# Altium schematic sheet UnivCotrollerV1.1.SchDoc
size 839 x 594 mm; ApprovedBy: Фадеев; CheckedBy: Ефименко; Author: Зильков; DrawnBy: Монтволинская; DocumentNumber: 1; SheetNumber: 1; SheetTotal: 1; PageSetup: Record=PageOptions|CenterHorizontal=True|CenterVertical=True|PrintScale=0.94|XCorrection=1.00|YCorrection=1.00|PrintKind=1|BorderSize=5000000|LeftOffset=0|BottomOffset=0|Orientation=1|PaperLength=1000|PaperWidth=1000|Scale=100|PaperSource=7|PrintQuality=-4|MediaType=1|DitherType=10|PaperKind=A4|PrintScaleMode=1; DecimalNumber: АДН200.80.01.100 Э3; MainDevice: АДН200.80.01.100
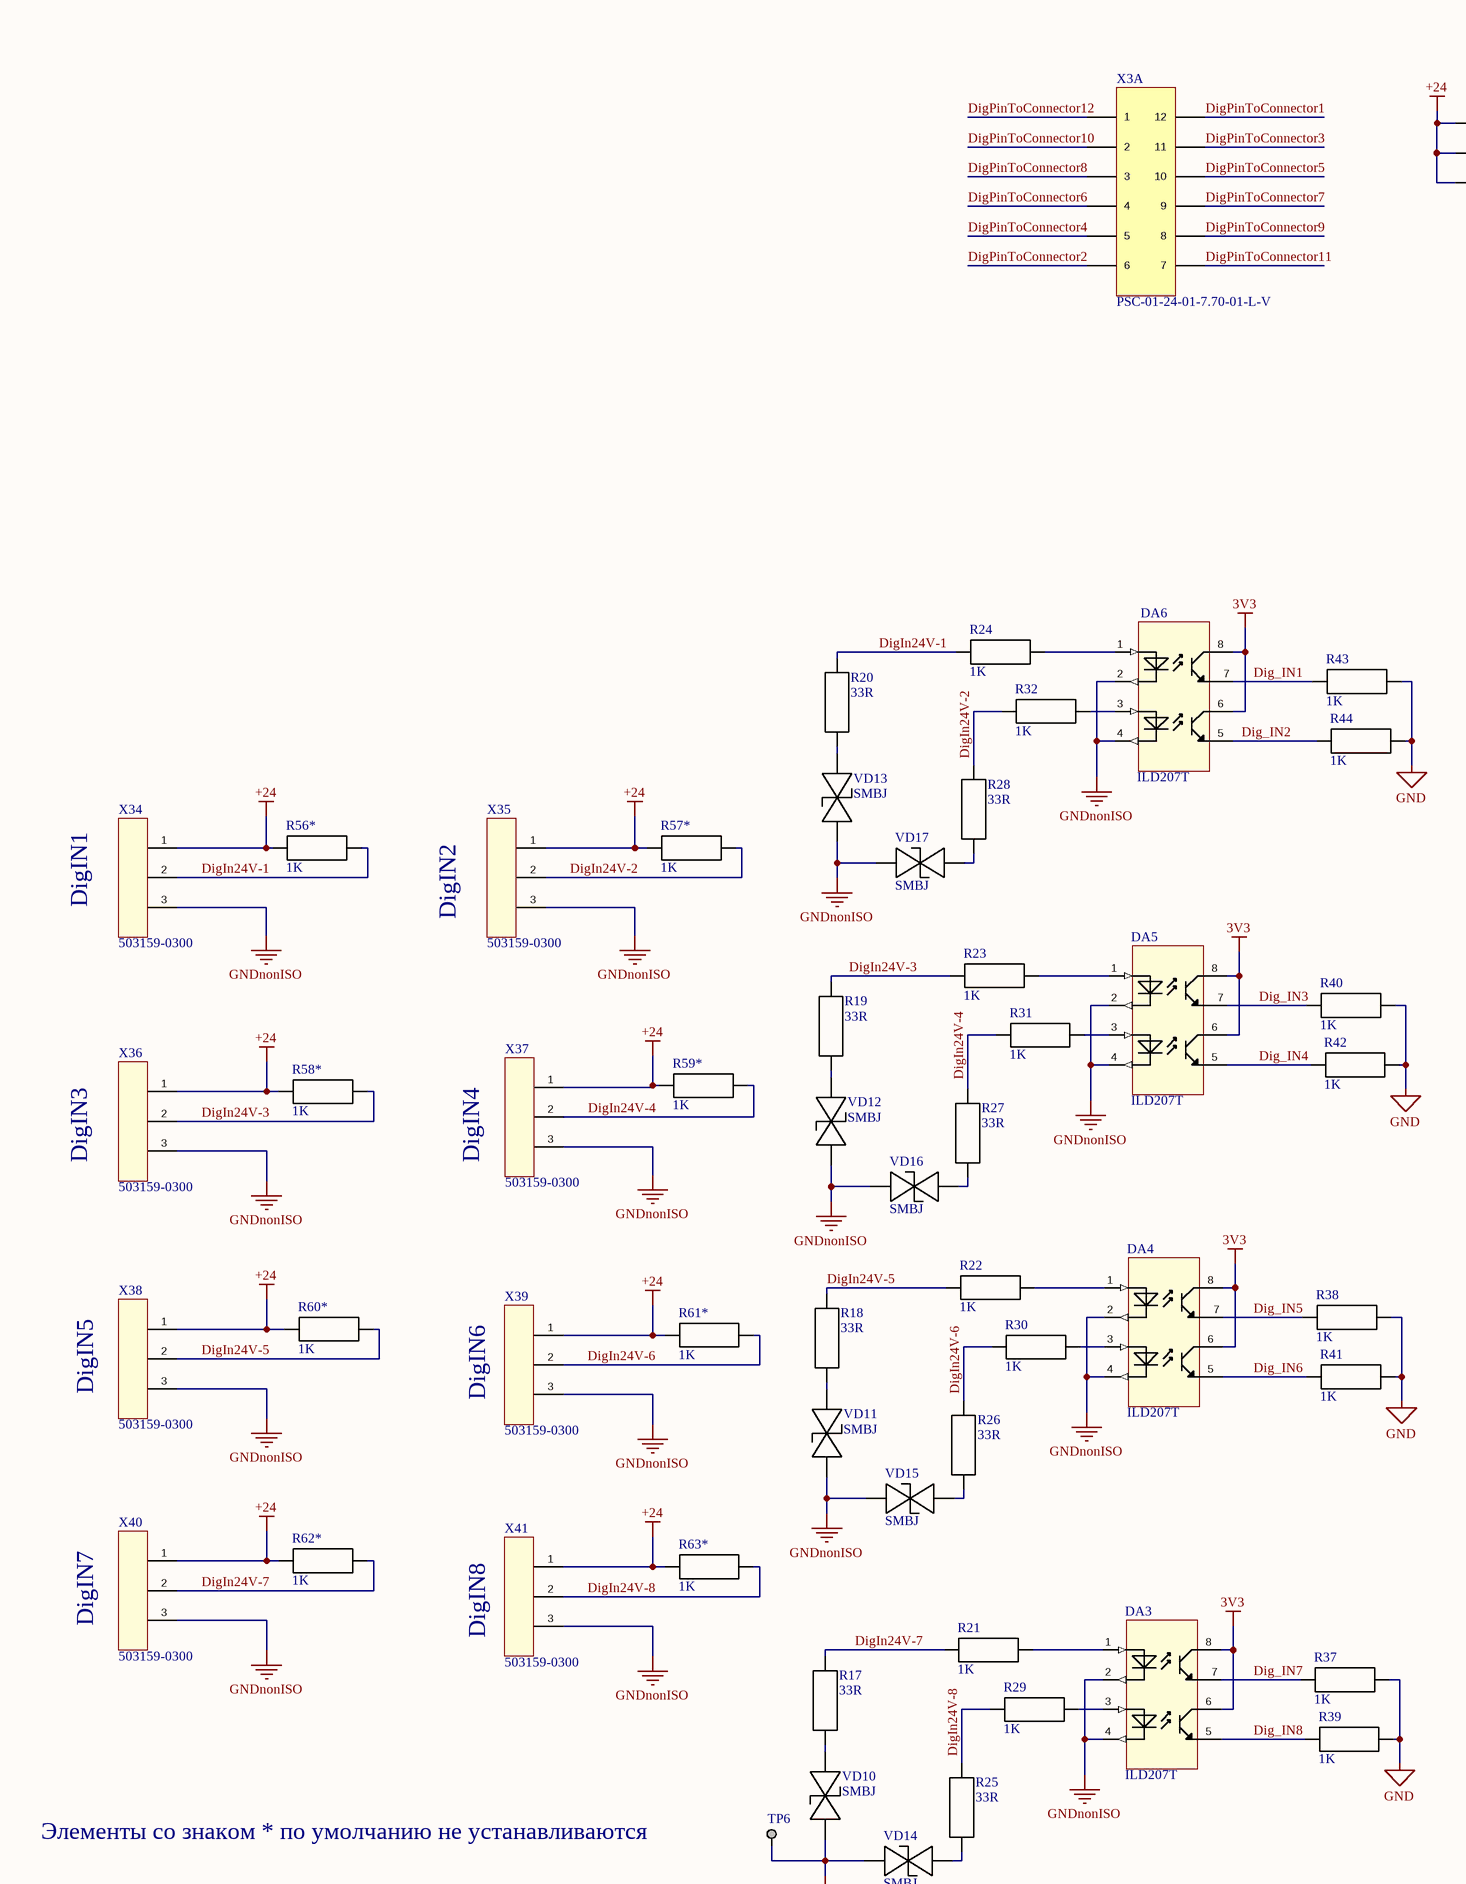
[diagram p0: UnivCotrollerV1.1.SchDoc, top left]
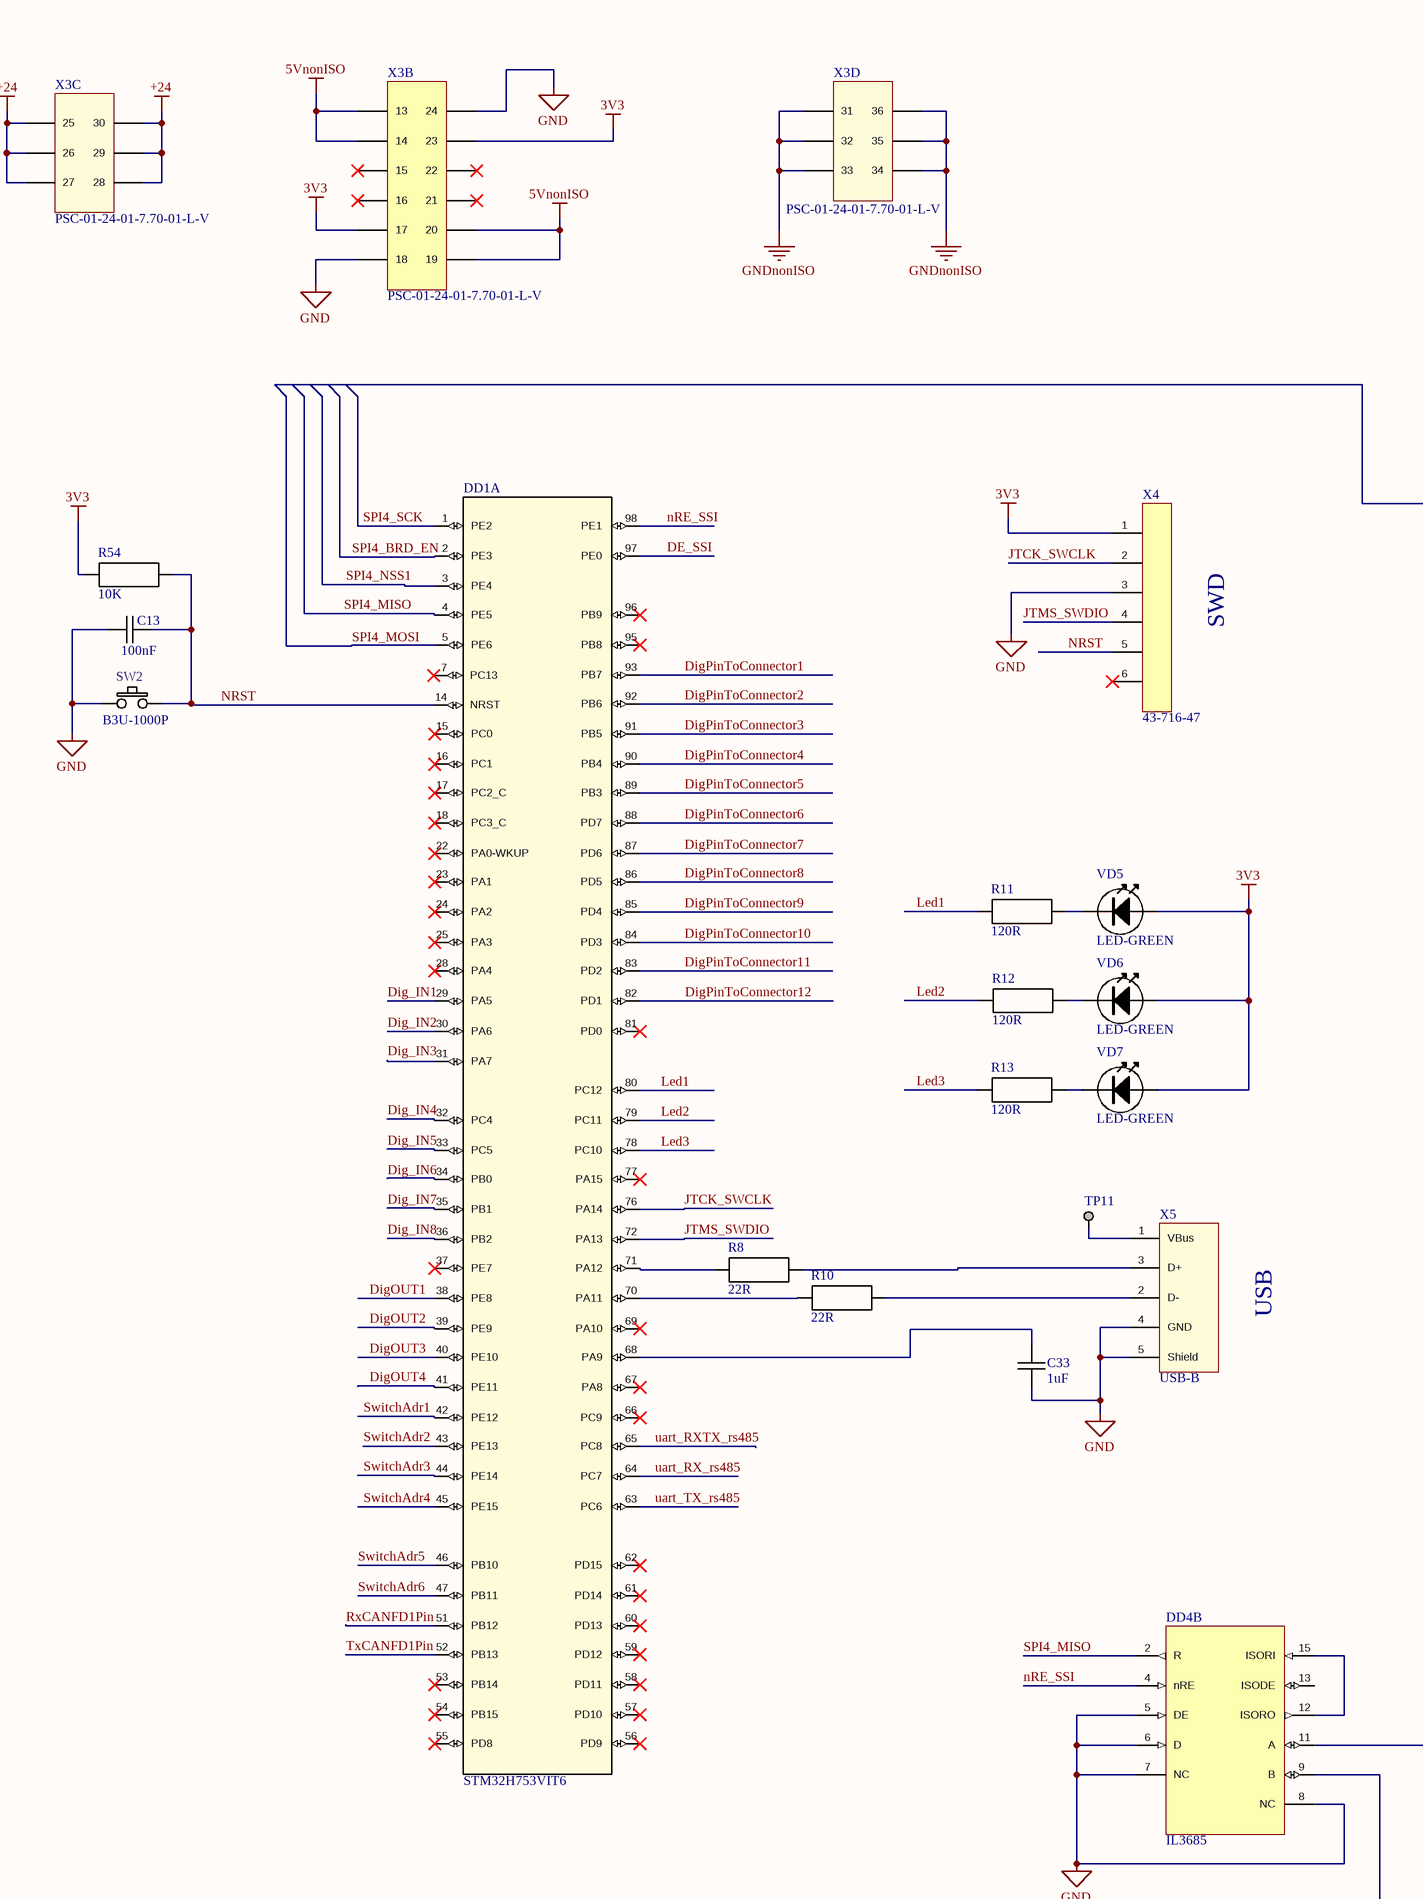
[diagram p1: UnivCotrollerV1.1.SchDoc, top middle]
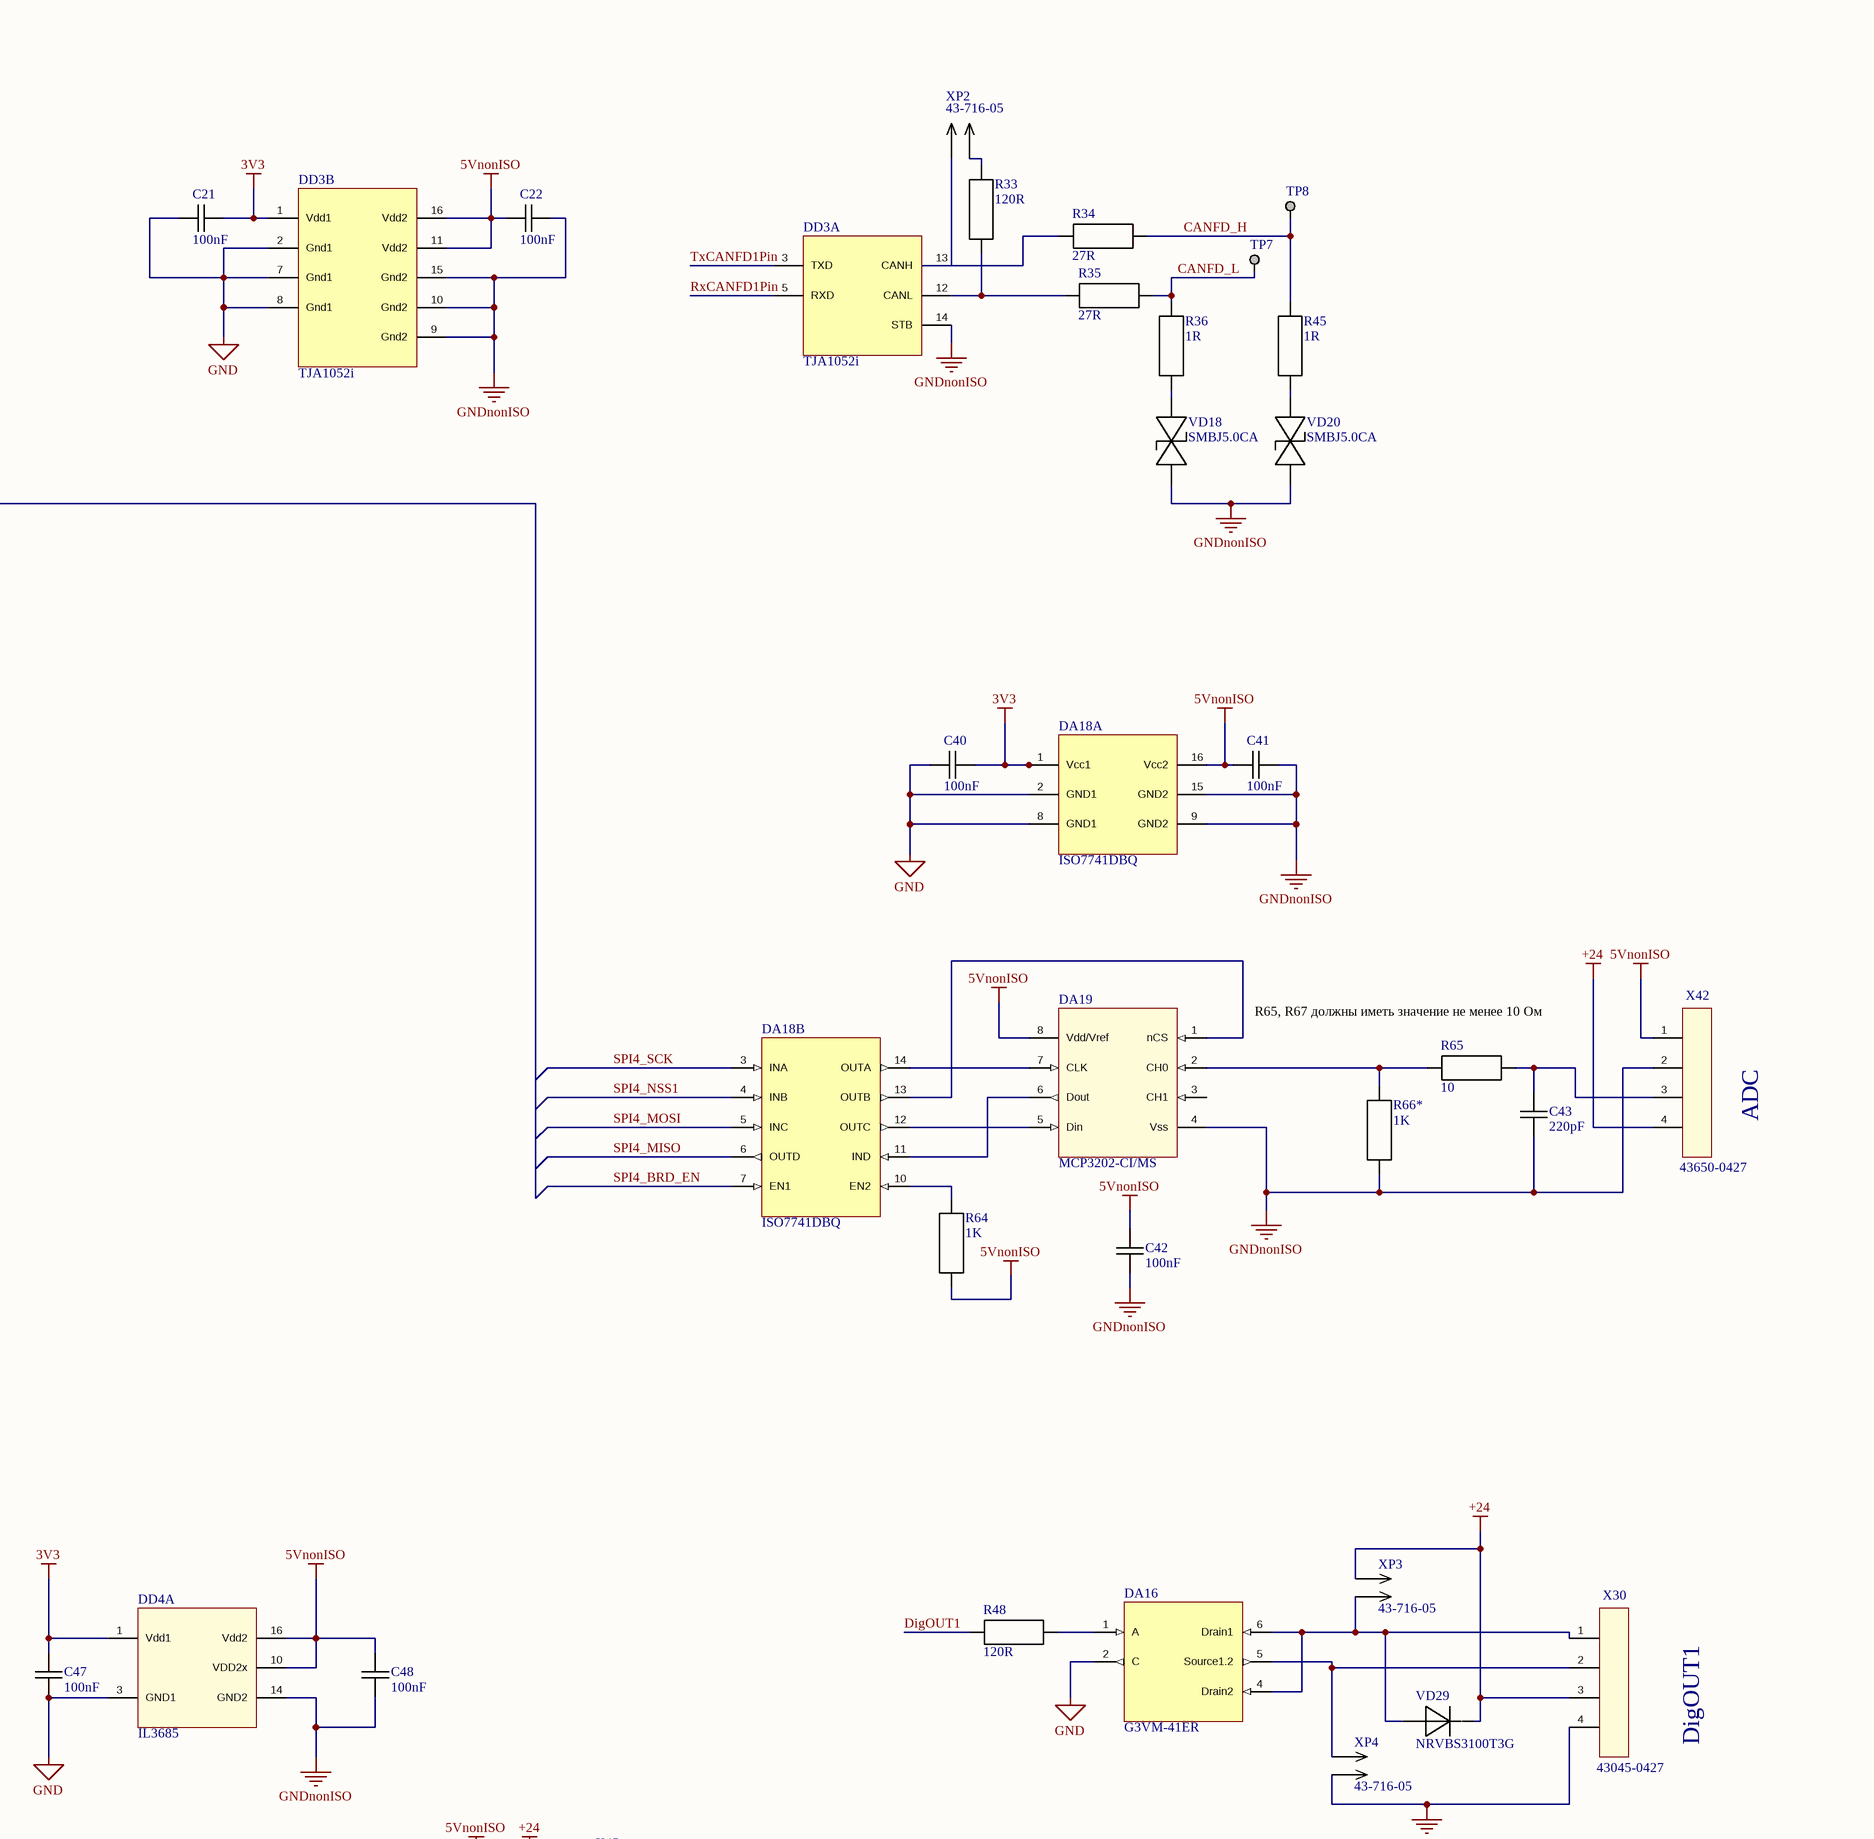
[diagram p2: UnivCotrollerV1.1.SchDoc, top right]
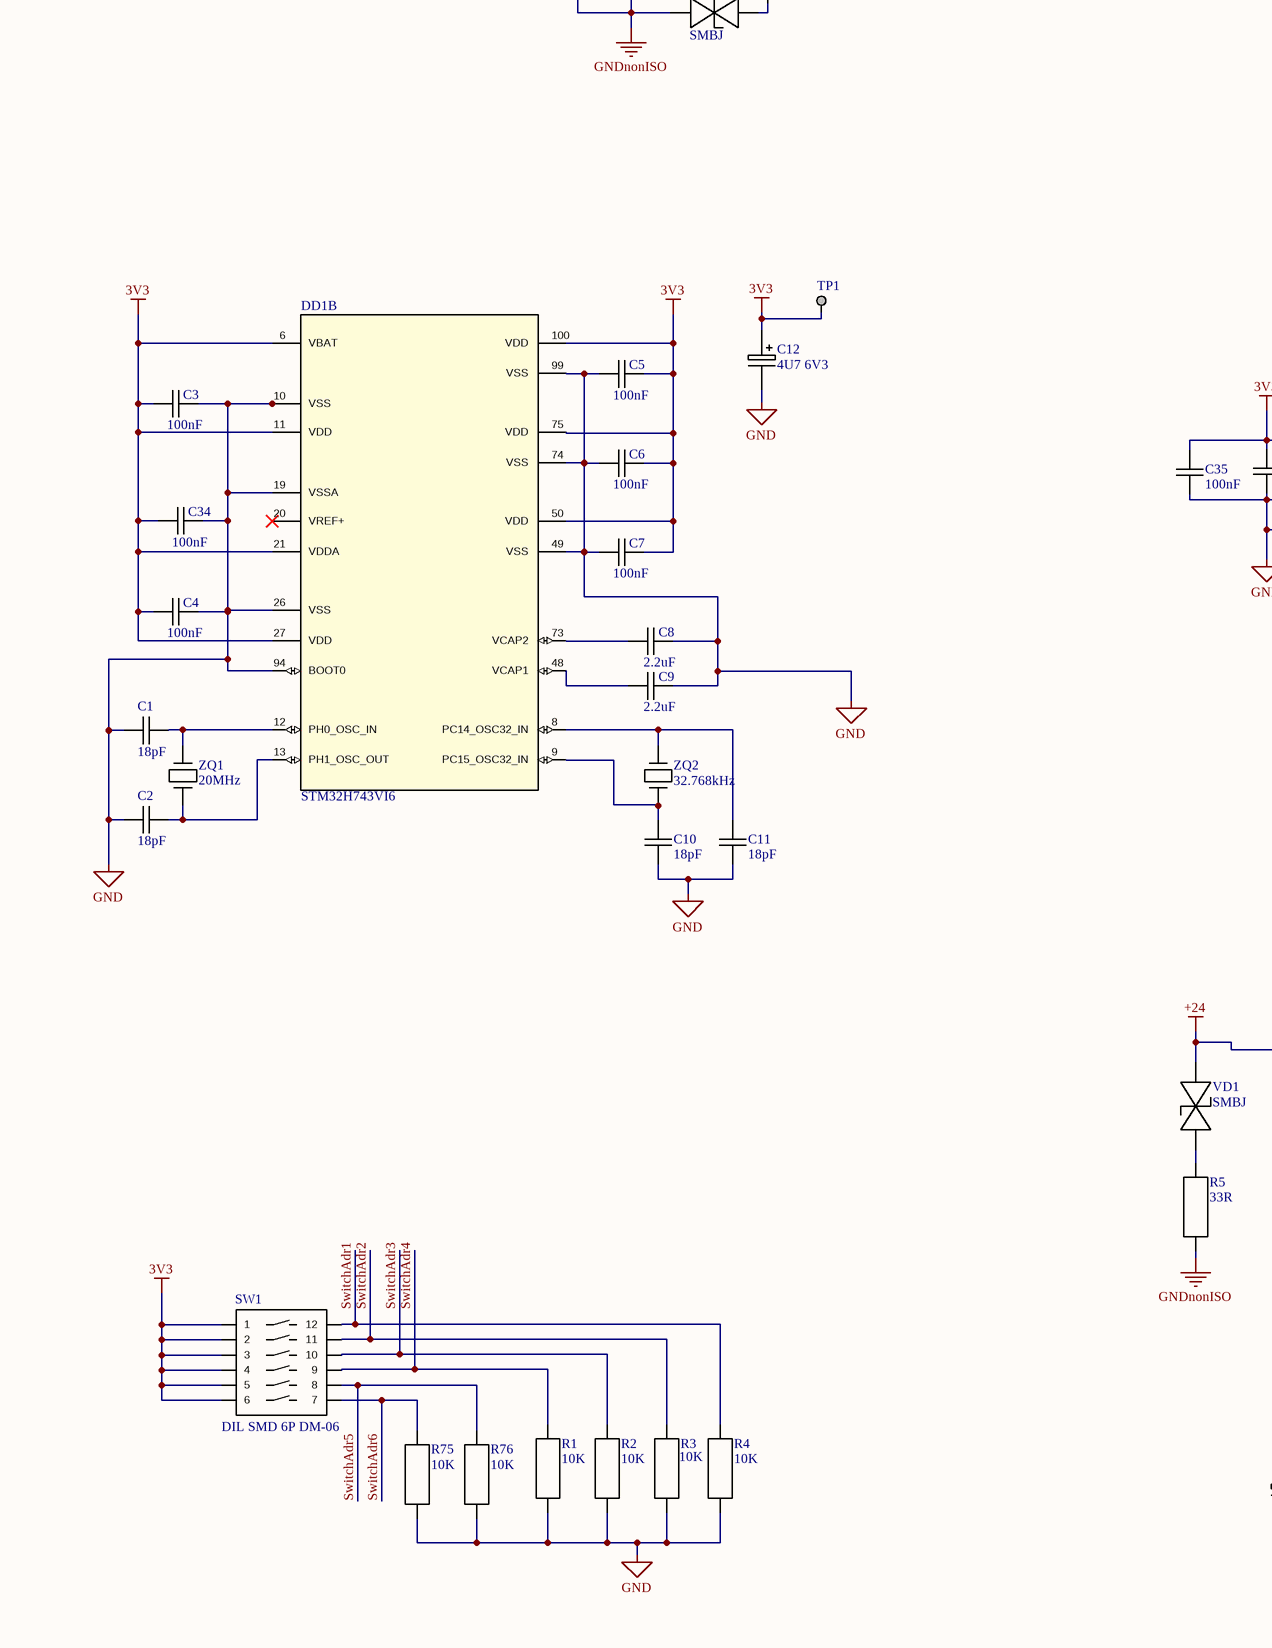
[diagram p3: UnivCotrollerV1.1.SchDoc, bottom left]
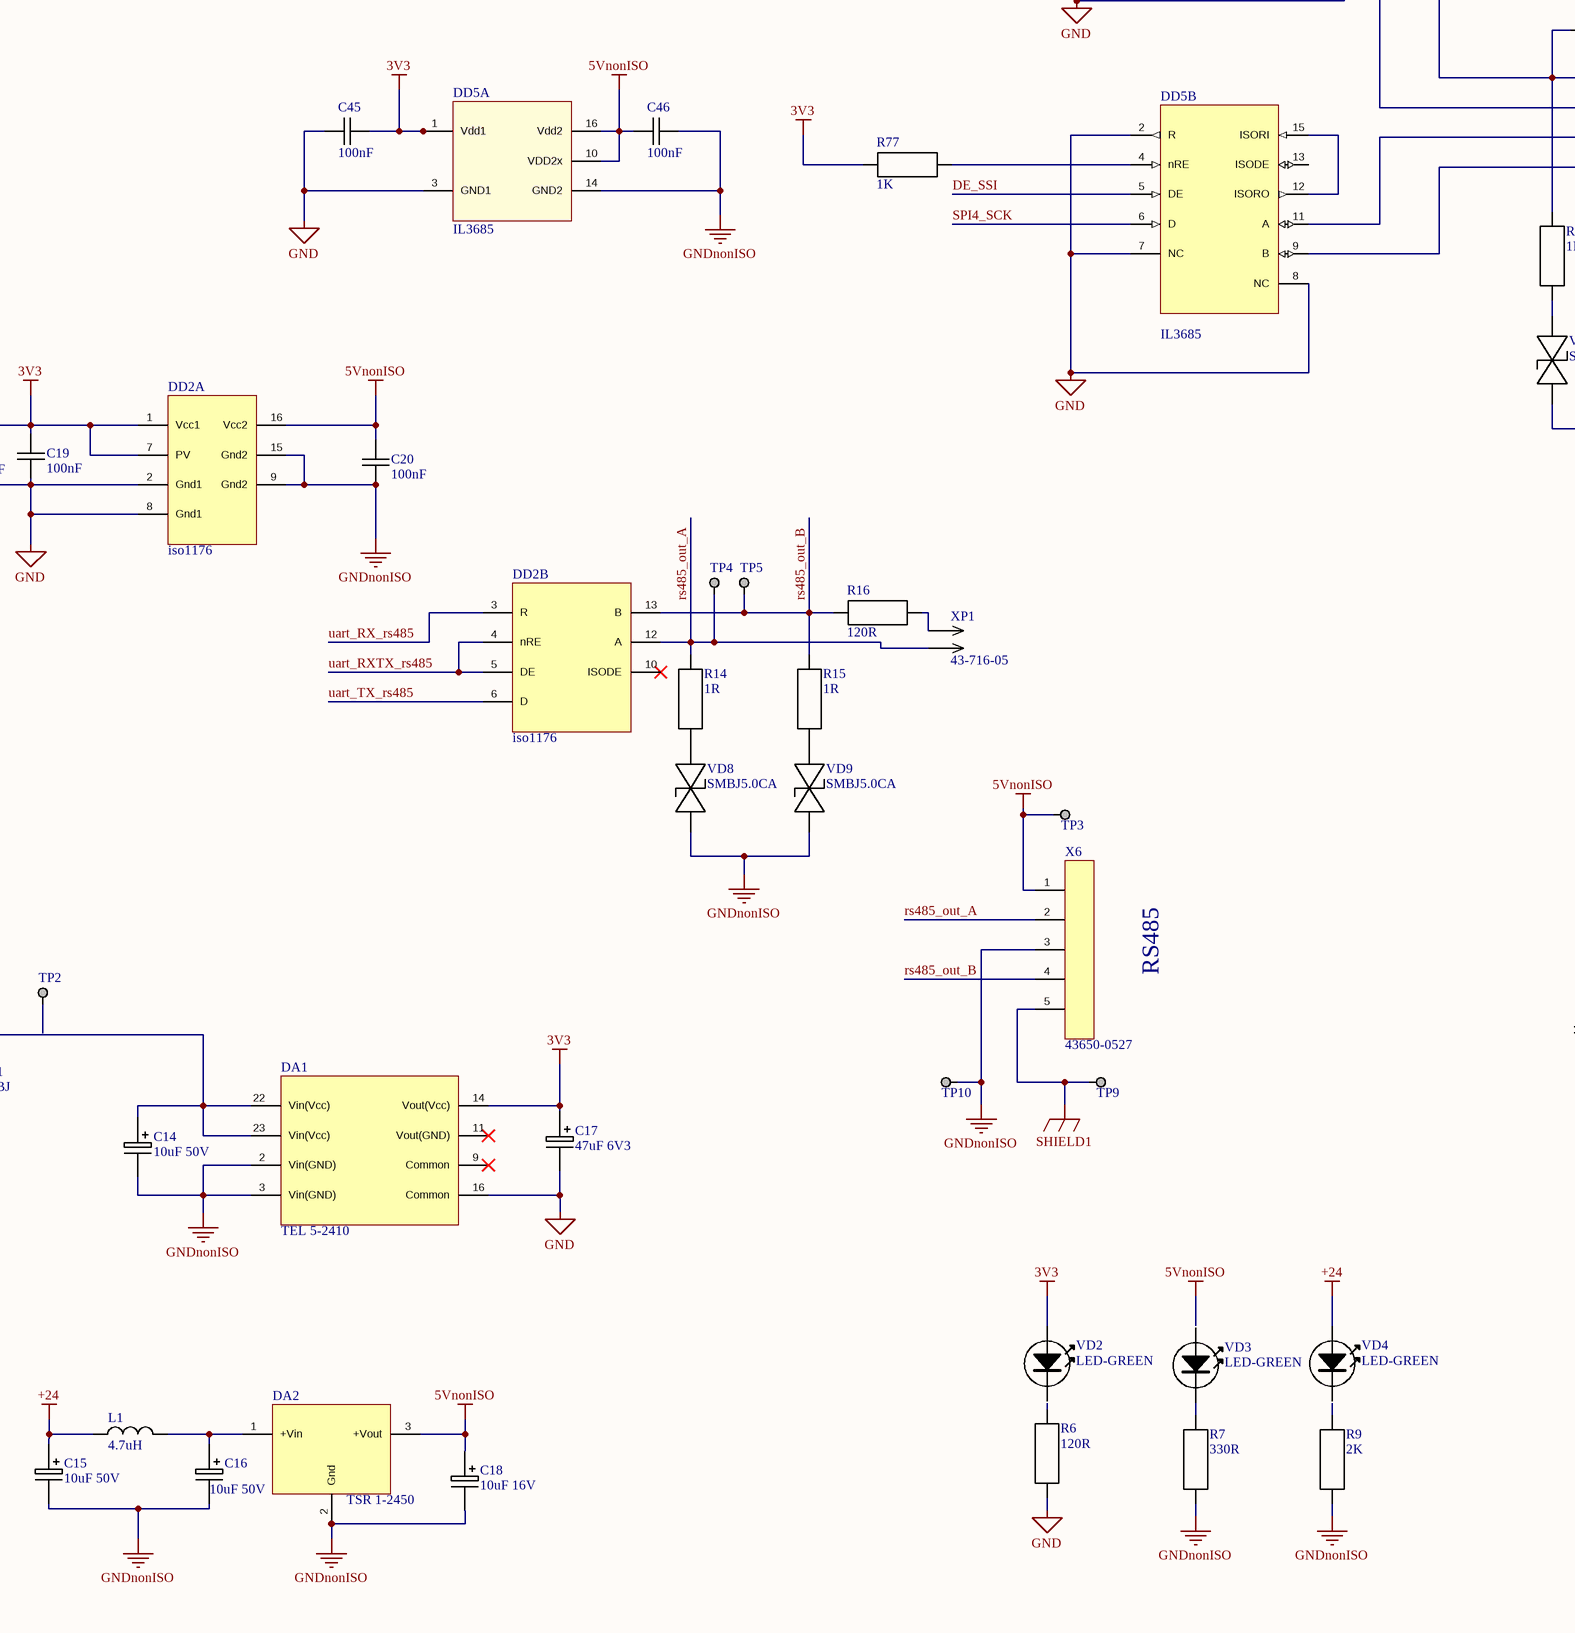
[diagram p4: UnivCotrollerV1.1.SchDoc, bottom middle]
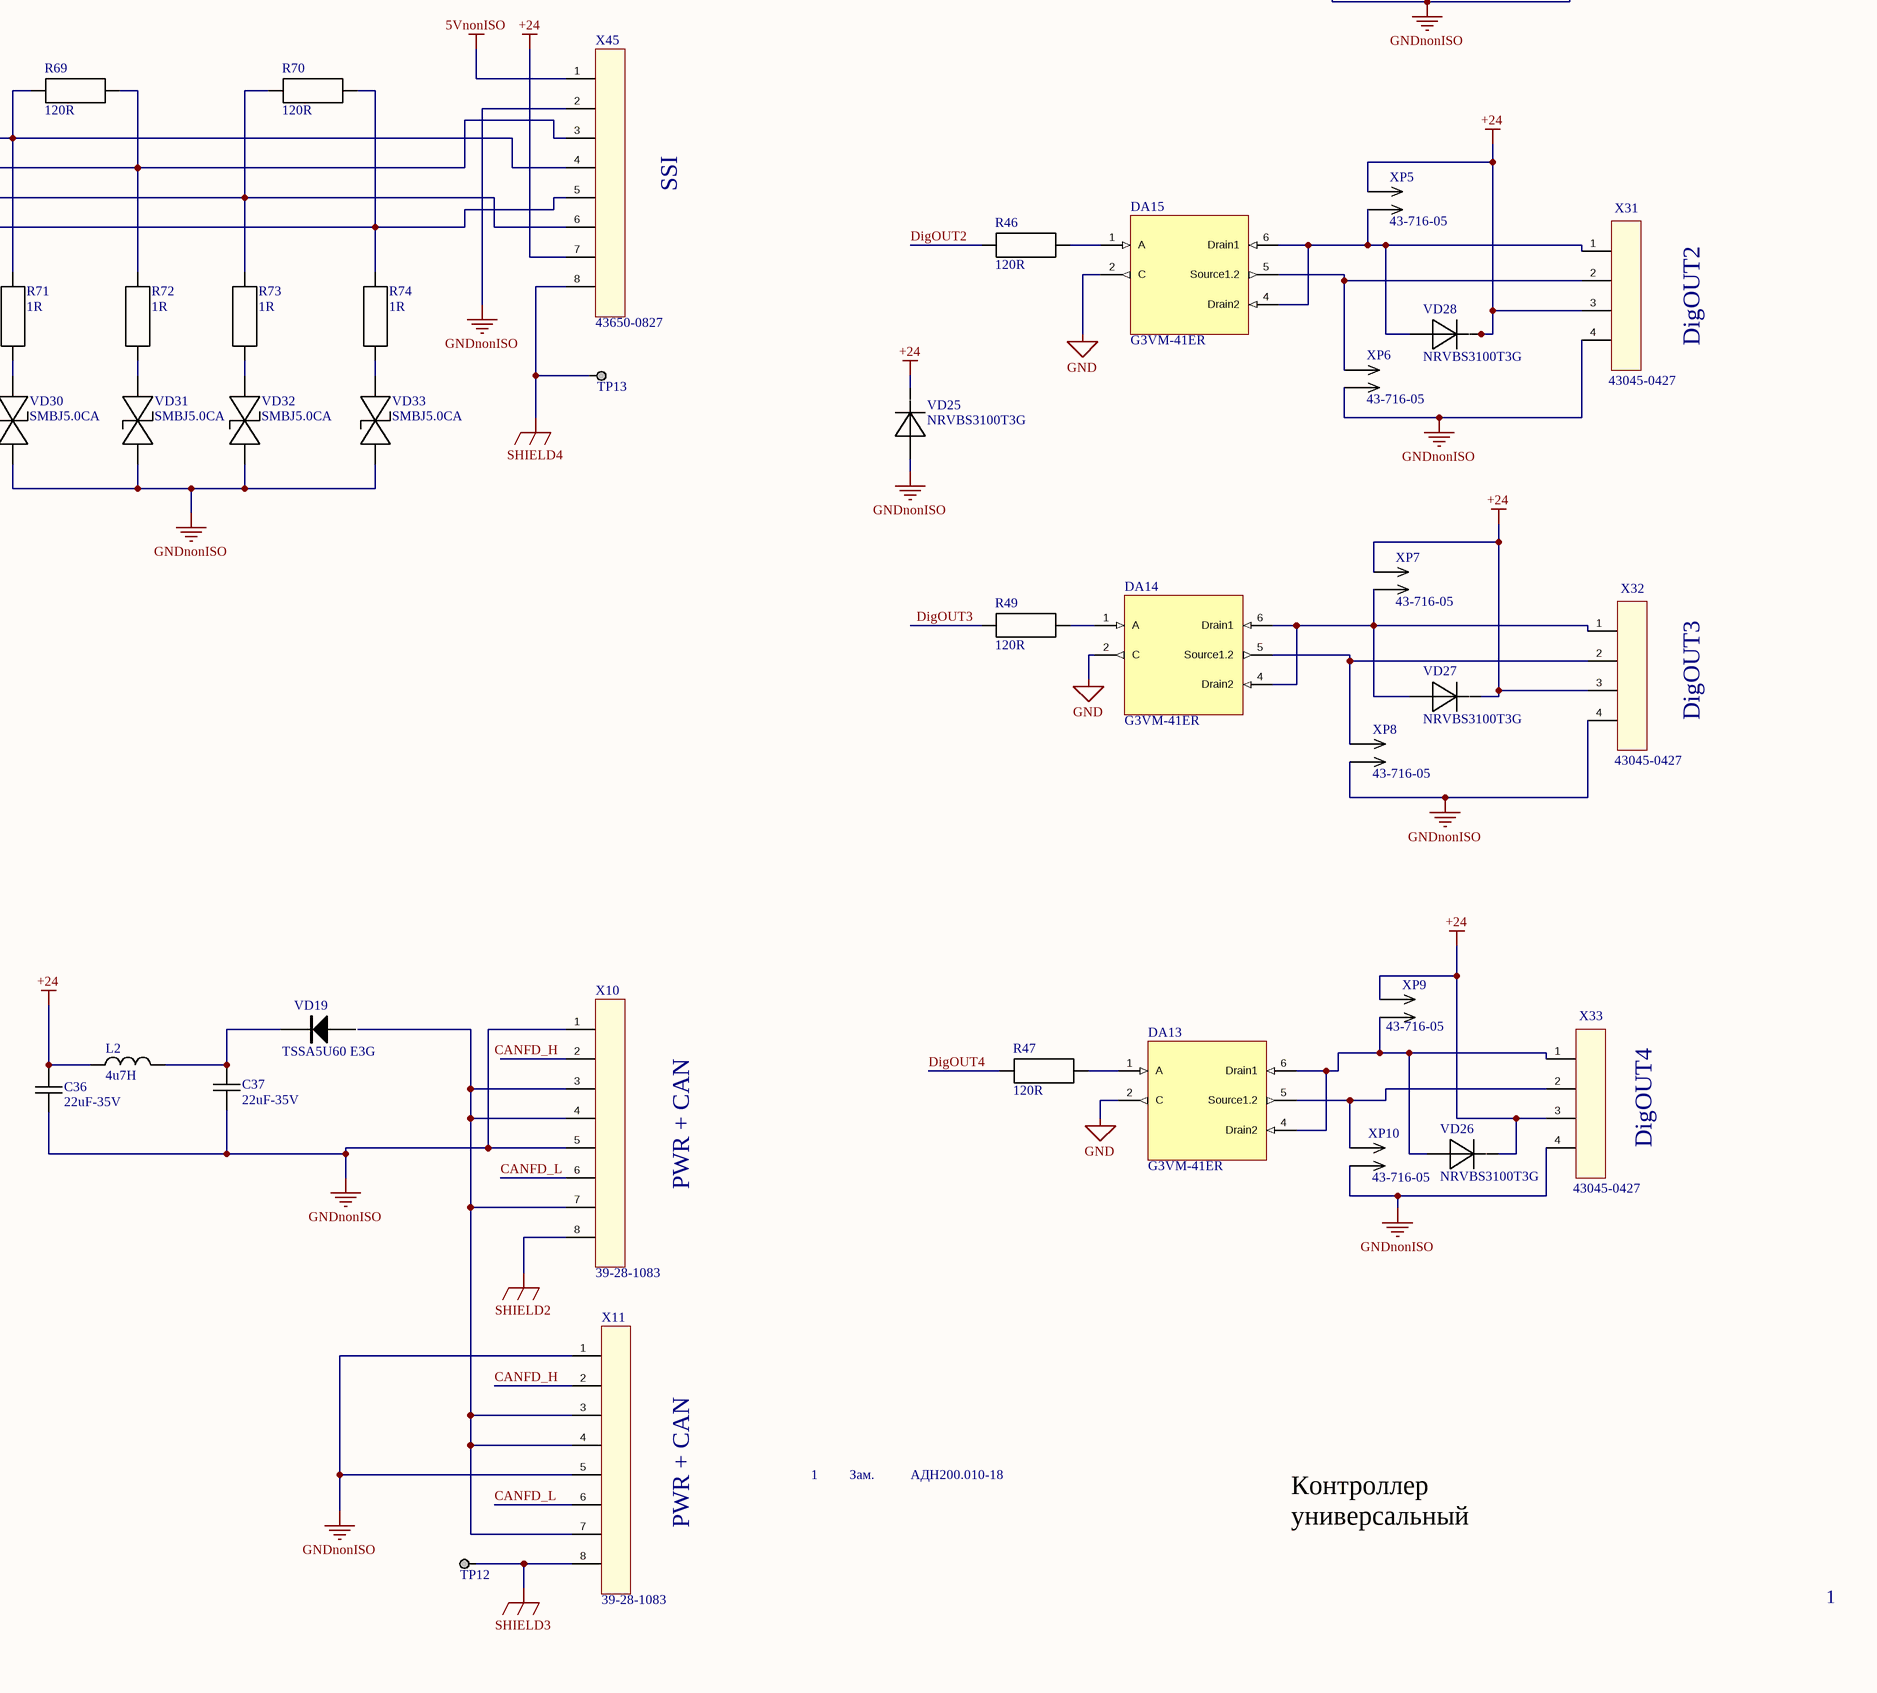
[diagram p5: UnivCotrollerV1.1.SchDoc, bottom right]

## Parts
C1  18pF  [0805C-GENERIC]
C2  18pF  [0805C-GENERIC]
C3  100nF  [0805C-GENERIC]
C4  100nF  [0805C-GENERIC]
C5  100nF  [0805C-GENERIC]
C6  100nF  [0805C-GENERIC]
C7  100nF  [0805C-GENERIC]
C8  2.2uF  [0805C-GENERIC]
C9  2.2uF  [0805C-GENERIC]
C10  18pF  [0805C-GENERIC]
C11  18pF  [0805C-GENERIC]
C12  4U7 6V3  [PANACAP-C]
C13  100nF  [0805C-GENERIC]
C14  10uF 50V  [PANACAP-D-GENERIC]
C15  10uF 50V  [PANACAP-D-GENERIC]
C16  10uF 50V  [PANACAP-D-GENERIC]
C17  47uF 6V3  [PANACAP-C]
C18  10uF 16V  [PANACAP-b]
C19  100nF  [0805C-TBD]
C20  100nF  [0805C-TBD]
C21  100nF  [0805C-GENERIC]
C22  100nF  [0805C-GENERIC]
C33  1uF  [0805C-GENERIC]
C34  100nF  [0805C-GENERIC]
C35  100nF  [0805C-TBD]
C36  22uF-35V
C37  22uF-35V
C40  100nF  [0805C-TBD]
C41  100nF  [0805C-TBD]
C42  100nF  [0805C-TBD]
C43  220pF  [0805C-TBD]
C45  100nF  [0805C-TBD]
C46  100nF  [0805C-TBD]
C47  100nF  [0805C-TBD]
C48  100nF  [0805C-TBD]
DA1  TEL 5-2410  [Traco power DIP-8]
DA2  TSR 1-2450  [TO-220]
DA3  ILD207T  [SMT8 (DIP)]
DA4  ILD207T  [SMT8 (DIP)]
DA5  ILD207T  [SMT8 (DIP)]
DA6  ILD207T  [SMT8 (DIP)]
DA13  G3VM-41ER  [SMT-6]
DA14  G3VM-41ER  [SMT-6]
DA15  G3VM-41ER  [SMT-6]
DA16  G3VM-41ER  [SMT-6]
DA18  ISO7741DBQ  (parts A,B of 2)
DA19  MCP3202-CI/MS  [SO8]
DD1  STM32H753VIT6  [LQFP100_M]  (parts A,B of 2)
DD2  iso1176  [SOIC16_W]  (parts A,B of 2)
DD3  TJA1052i  [SOIC16_W]  (parts A,B of 2)
DD4  IL3685  (parts A,B of 2)
DD5  IL3685  (parts A,B of 2)
L1  4.7uH  [0805C-GENERIC]
L2  4u7H  [TDK-VLS3012-4U7]
R1  10K  [0805R-10K]
R2  10K  [0805R-10K]
R3  10K  [0805R-10K]
R4  10K  [0805R-10K]
R5  33R  [0805R-33]
R6  120R  [0805R-120]
R7  330R  [0805R-330]
R8  22R  [0805R-22]
R9  2K  [0805R-1K2]
R10  22R  [0805R-22]
R11  120R  [0805R-120]
R12  120R  [0805R-120]
R13  120R  [0805R-120]
R14  1R  [0805R-GENERIC]
R15  1R  [0805R-GENERIC]
R16  120R  [0805R-120]
R17  33R  [0805R-33]
R18  33R  [0805R-33]
R19  33R  [0805R-33]
R20  33R  [0805R-33]
R21  1K  [0805R-1K]
R22  1K  [0805R-1K]
R23  1K  [0805R-1K]
R24  1K  [0805R-1K]
R25  33R  [0805R-33]
R26  33R  [0805R-33]
R27  33R  [0805R-33]
R28  33R  [0805R-33]
R29  1K  [0805R-1K]
R30  1K  [0805R-1K]
R31  1K  [0805R-1K]
R32  1K  [0805R-1K]
R33  120R  [0805R-120]
R34  27R  [0805R-27]
R35  27R  [0805R-27]
R36  1R  [0805R-GENERIC]
R37  1K  [0805R-1K]
R38  1K  [0805R-1K]
R39  1K  [0805R-1K]
R40  1K  [0805R-1K]
R41  1K  [0805R-1K]
R42  1K  [0805R-1K]
R43  1K  [0805R-1K]
R44  1K  [0805R-1K]
R45  1R  [0805R-GENERIC]
R46  120R  [0805R-120]
R47  120R  [0805R-120]
R48  120R  [0805R-120]
R49  120R  [0805R-120]
R54  10K  [0805R-10K]
R56*  1K  [0805R-1K]
R57*  1K  [0805R-1K]
R58*  1K  [0805R-1K]
R59*  1K  [0805R-1K]
R60*  1K  [0805R-1K]
R61*  1K  [0805R-1K]
R62*  1K  [0805R-1K]
R63*  1K  [0805R-1K]
R64  1K  [0805R-1K]
R65  10  [0805R-1K]
R66*  1K  [0805R-1K]
R69  120R  [0805R-120]
R70  120R  [0805R-120]
R71  1R  [0805R-GENERIC]
R72  1R  [0805R-GENERIC]
R73  1R  [0805R-GENERIC]
R74  1R  [0805R-GENERIC]
R75  10K  [0805R-10K]
R76  10K  [0805R-10K]
R77  1K  [0805R-1K]
SW1  DIL SMD 6P DM-06  [SO12SW]
SW2  B3U-1000P  [SW-PB-BLUE-ROUND4]
TP1  TESTPOINT  [TESTPOINT]  (value not drawn)
TP2  TESTPOINT  [TESTPOINT]  (value not drawn)
TP3  TESTPOINT  [TESTPOINT]  (value not drawn)
TP4  TESTPOINT  [TESTPOINT]  (value not drawn)
TP5  TESTPOINT  [TESTPOINT]  (value not drawn)
TP6  TESTPOINT  [TESTPOINT]  (value not drawn)
TP7  TESTPOINT  [TESTPOINT]  (value not drawn)
TP8  TESTPOINT  [TESTPOINT]  (value not drawn)
TP9  TESTPOINT  [TESTPOINT]  (value not drawn)
TP10  TESTPOINT  [TESTPOINT]  (value not drawn)
TP11  TESTPOINT  [TESTPOINT]  (value not drawn)
TP12  TESTPOINT  [TESTPOINT]  (value not drawn)
TP13  TESTPOINT  [TESTPOINT]  (value not drawn)
VD1  SMBJ  [DIODE-SMB]
VD2  LED-GREEN  [0805LED]
VD3  LED-GREEN  [0805LED]
VD4  LED-GREEN  [0805LED]
VD5  LED-GREEN  [0805LED]
VD6  LED-GREEN  [0805LED]
VD7  LED-GREEN  [0805LED]
VD8  SMBJ5.0CA  [DIODE-SMB]
VD9  SMBJ5.0CA  [DIODE-SMB]
VD10  SMBJ  [DIODE-SMB]
VD11  SMBJ  [DIODE-SMB]
VD12  SMBJ  [DIODE-SMB]
VD13  SMBJ  [DIODE-SMB]
VD14  SMBJ  [DIODE-SMB]
VD15  SMBJ  [DIODE-SMB]
VD16  SMBJ  [DIODE-SMB]
VD17  SMBJ  [DIODE-SMB]
VD18  SMBJ5.0CA  [DIODE-SMB]
VD19  TSSA5U60 E3G  [DIODE-SMA]
VD20  SMBJ5.0CA  [DIODE-SMB]
VD25  NRVBS3100T3G  [DIODE-SMC]
VD26  NRVBS3100T3G  [DIODE-SMC]
VD27  NRVBS3100T3G  [DIODE-SMC]
VD28  NRVBS3100T3G  [DIODE-SMC]
VD29  NRVBS3100T3G  [DIODE-SMC]
VD30  SMBJ5.0CA  [DIODE-SMB]
VD31  SMBJ5.0CA  [DIODE-SMB]
VD32  SMBJ5.0CA  [DIODE-SMB]
VD33  SMBJ5.0CA  [DIODE-SMB]
X3  PSC-01-24-01-7.70-01-L-V  (parts A,B,C,D of 4)
X4  43-716-47  [HEADER-1X6]
X5  USB-B  [USB-B]
X6  43650-0527  [HEADER-1X5]
X10  39-28-1083  [HEADER-1X8]
X11  39-28-1083  [HEADER-1X8]
X30  43045-0427  [HEADER-1X4]
X31  43045-0427  [HEADER-1X4]
X32  43045-0427  [HEADER-1X4]
X33  43045-0427  [HEADER-1X4]
X34  503159-0300  [HEADER-1X3]
X35  503159-0300  [HEADER-1X3]
X36  503159-0300  [HEADER-1X3]
X37  503159-0300  [HEADER-1X3]
X38  503159-0300  [HEADER-1X3]
X39  503159-0300  [HEADER-1X3]
X40  503159-0300  [HEADER-1X3]
X41  503159-0300  [HEADER-1X3]
X42  43650-0427  [HEADER-1X4]
X45  43650-0827  [HEADER-1X8]
XP1  43-716-05  [HEADER-1X2]
XP2  43-716-05  [HEADER-1X2]
XP3  43-716-05  [HEADER-1X2]
XP4  43-716-05  [HEADER-1X2]
XP5  43-716-05  [HEADER-1X2]
XP6  43-716-05  [HEADER-1X2]
XP7  43-716-05  [HEADER-1X2]
XP8  43-716-05  [HEADER-1X2]
XP9  43-716-05  [HEADER-1X2]
XP10  43-716-05  [HEADER-1X2]
ZQ1  20MHz  [XTAL-RU49/4]
ZQ2  32.768kHz  [XTAL-RU49/4]

## Nets
3V3: C3.1 C4.1 C5.2 C6.2 C7.2 C12.+ C17.+ C19.1 C21.2 C34.1 C35.1 C40.2 C45.2 C47.1 DA1.14(Vout(Vcc)) DA3.6(C2) DA3.8(C1) DA4.6(C2) DA4.8(C1) DA5.6(C2) DA5.8(C1) DA6.6(C2) DA6.8(C1) DA18.1(Vcc1) DD1.6(VBAT) DD1.11(VDD) DD1.21(VDDA) DD1.27(VDD) DD1.50(VDD) DD1.75(VDD) DD1.100(VDD) DD2.1(Vcc1) DD2.7(PV) DD3.1(Vdd1) DD4.1(Vdd1) DD5.1(Vdd1) R54.2 R77.1 SW1.1 SW1.2 SW1.3 SW1.4 SW1.5 SW1.6 TP1.1 VD2.A VD5.A VD6.A VD7.A X3.17 X3.23 X4.1
5VnonISO: C18.+ C20.1 C22.2 C41.1 C42.2 C46.1 C48.1 DA2.3(+Vout) DA18.16(Vcc2) DA19.8(Vdd/Vref) DD2.16(Vcc2) DD3.11(Vdd2) DD3.16(Vdd2) DD4.10(VDD2x) DD4.16(Vdd2) DD5.10(VDD2x) DD5.16(Vdd2) R64.2 TP3.1 X3.13 X3.14 X3.19 X3.20 X6.1 X42.1 X45.1
+24: C14.+ C15.+ C36.1 DA1.22(Vin(Vcc)) DA1.23(Vin(Vcc)) L1.1 L2.1 R56*.1 R57*.1 R58*.1 R59*.1 R60*.1 R61*.1 R62*.1 R63*.1 VD1.1(A) VD4.A VD25.K VD26.K VD27.K VD28.K VD29.K X3.25 X3.26 X3.27 X3.28 X3.29 X3.30 X30.3 X31.3 X32.3 X33.3 X34.1 X35.1 X36.1 X37.1 X38.1 X39.1 X40.1 X41.1 X42.4 X45.7 XP3.1 XP5.1 XP7.1 XP9.1
GND: C1.1 C2.1 C3.2 C4.2 C5.1 C6.1 C7.1 C8.1 C9.1 C10.2 C11.2 C12.- C13.1 C17.- C19.2 C21.1 C33.1 C34.2 C35.2 C40.1 C45.1 C47.2 DA1.16(Common) DA13.2(C) DA14.2(C) DA15.2(C) DA16.2(C) DA18.2(GND1) DA18.8(GND1) DD1.10(VSS) DD1.19(VSSA) DD1.26(VSS) DD1.49(VSS) DD1.74(VSS) DD1.94(BOOT0) DD1.99(VSS) DD2.2(Gnd1) DD2.8(Gnd1) DD3.2(Gnd1) DD3.7(Gnd1) DD3.8(Gnd1) DD4.3(GND1) DD4.5(DE) DD4.6(D) DD4.7(NC) DD4.8(NC) DD5.2(R) DD5.3(GND1) DD5.7(NC) DD5.8(NC) R1.1 R2.1 R3.1 R4.1 R6.2 R37.2 R38.2 R39.2 R40.2 R41.2 R42.2 R43.2 R44.2 R75.1 R76.1 SW2.1 X3.18 X3.24 X4.3 X5.4(GND) X5.5(Shield)
GNDnonISO: C14.- C15.- C16.- C18.- C20.2 C22.1 C36.2 C37.2 C41.2 C42.1 C43.1 C46.2 C48.2 DA1.2(Vin(GND)) DA1.3(Vin(GND)) DA2.2(Gnd) DA3.2(C1) DA3.4(C2) DA4.2(C1) DA4.4(C2) DA5.2(C1) DA5.4(C2) DA6.2(C1) DA6.4(C2) DA18.9(GND2) DA18.15(GND2) DA19.4(Vss) DD2.9(Gnd2) DD2.15(Gnd2) DD3.9(Gnd2) DD3.10(Gnd2) DD3.14(STB) DD3.15(Gnd2) DD4.14(GND2) DD5.14(GND2) R5.2 R7.2 R9.2 R66*.1 TP6.1 TP10.1 VD8.1(A) VD9.1(A) VD10.2(K) VD11.2(K) VD12.2(K) VD13.2(K) VD14.2(K) VD15.2(K) VD16.2(K) VD17.2(K) VD18.1(A) VD20.1(A) VD25.A VD30.1(A) VD31.1(A) VD32.1(A) VD33.1(A) X3.31 X3.32 X3.33 X3.34 X3.35 X3.36 X6.3 X10.1 X10.5 X11.1 X11.5 X30.4 X31.4 X32.4 X33.4 X34.3 X35.3 X36.3 X37.3 X38.3 X39.3 X40.3 X41.3 X42.2 X45.2 XP4.2 XP6.2 XP8.2 XP10.2
SHIELD1: TP9.1 X6.5
SHIELD2: X10.8
SHIELD3: TP12.1 X11.8
SHIELD4: TP13.1 X45.8
CANFD_H: R34.2 R45.2 TP8.1 X11.2
CANFD_L: R35.2 R36.2 TP7.1 X10.6 X11.6
DE_SSI: DD1.97(PE0) DD5.5(DE)
Dig_IN1: DA6.7(E1) DD1.29(PA5) R43.1
Dig_IN2: DA6.5(E2) DD1.30(PA6) R44.1
Dig_IN3: DA5.7(E1) DD1.31(PA7) R40.1
Dig_IN4: DA5.5(E2) DD1.32(PC4) R42.1
Dig_IN5: DA4.7(E1) DD1.33(PC5) R38.1
Dig_IN6: DA4.5(E2) DD1.34(PB0) R41.1
Dig_IN7: DA3.7(E1) DD1.35(PB1) R37.1
Dig_IN8: DA3.5(E2) DD1.36(PB2) R39.1
DigIn24V-1: R20.1 R24.1 R56*.2 X34.2
DigIn24V-2: R28.1 R32.1 R57*.2 X35.2
DigIn24V-3: R19.1 R23.1 R58*.2 X36.2
DigIn24V-4: R27.1 R31.1 R59*.2 X37.2
DigIn24V-5: R18.1 R22.1 R60*.2 X38.2
DigIn24V-6: R26.1 R30.1 R61*.2 X39.2
DigIn24V-7: R17.1 R21.1 R62*.2 X40.2
DigIn24V-8: R25.1 R29.1 R63*.2 X41.2
DigOUT1: DD1.38(PE8) R48.1
DigOUT2: DD1.39(PE9) R46.1
DigOUT3: DD1.40(PE10) R49.1
DigOUT4: DD1.41(PE11) R47.1
DigPinToConnector1: DD1.93(PB7) X3.12
DigPinToConnector2: DD1.92(PB6) X3.6
DigPinToConnector3: DD1.91(PB5) X3.11
DigPinToConnector4: DD1.90(PB4) X3.5
DigPinToConnector5: DD1.89(PB3) X3.10
DigPinToConnector6: DD1.88(PD7) X3.4
DigPinToConnector7: DD1.87(PD6) X3.9
DigPinToConnector8: DD1.86(PD5) X3.3
DigPinToConnector9: DD1.85(PD4) X3.8
DigPinToConnector10: DD1.84(PD3) X3.2
DigPinToConnector11: DD1.83(PD2) X3.7
DigPinToConnector12: DD1.82(PD1) X3.1
JTCK_SWCLK: DD1.76(PA14) X4.2
JTMS_SWDIO: DD1.72(PA13) X4.4
Led1: DD1.80(PC12) R11.1
Led2: DD1.79(PC11) R12.1
Led3: DD1.78(PC10) R13.1
nRE_SSI: DD1.98(PE1) DD4.4(nRE)
NRST: C13.2 DD1.14(NRST) R54.1 SW2.2 X4.5
rs485_out_A: DD2.12(A) R14.2 TP4.1 X6.2 XP1.2
rs485_out_B: DD2.13(B) R15.2 R16.1 TP5.1 X6.4
RxCANFD1Pin: DD1.51(PB12) DD3.5(RXD)
SPI4_BRD_EN: DA18.7(EN1) DD1.2(PE3)
SPI4_MISO: DA18.6(OUTD) DD1.4(PE5) DD4.2(R)
SPI4_MOSI: DA18.5(INC) DD1.5(PE6)
SPI4_NSS1: DA18.4(INB) DD1.3(PE4)
SPI4_SCK: DA18.3(INA) DD1.1(PE2) DD5.6(D)
SwitchAdr1: DD1.42(PE12) R4.2 SW1.12
SwitchAdr2: DD1.43(PE13) R3.2 SW1.11
SwitchAdr3: DD1.44(PE14) R2.2 SW1.10
SwitchAdr4: DD1.45(PE15) R1.2 SW1.9
SwitchAdr5: DD1.46(PB10) R76.2 SW1.8
SwitchAdr6: DD1.47(PB11) R75.2 SW1.7
TxCANFD1Pin: DD1.52(PB13) DD3.3(TXD)
uart_RX_rs485: DD1.64(PC7) DD2.3(R)
uart_RXTX_rs485: DD1.65(PC8) DD2.4(nRE) DD2.5(DE)
uart_TX_rs485: DD1.63(PC6) DD2.6(D)
NetC1_2: C1.2 DD1.12(PH0_OSC_IN) ZQ1.1
NetC2_2: C2.2 DD1.13(PH1_OSC_OUT) ZQ1.2
NetC8_2: C8.2 DD1.73(VCAP2)
NetC9_2: C9.2 DD1.48(VCAP1)
NetC10_1: C10.1 DD1.9(PC15_OSC32_IN) ZQ2.2
NetC11_1: C11.1 DD1.8(PC14_OSC32_IN) ZQ2.1
NetC16_+: C16.+ DA2.1(+Vin) L1.2
NetC33_2: C33.2 DD1.68(PA9)
NetC37_1: C37.1 L2.2 VD19.K
NetC43_2: C43.2 R65.2 X42.3
NetDA3_1: DA3.1(A1) R21.2
NetDA3_3: DA3.3(A2) R29.2
NetDA4_1: DA4.1(A1) R22.2
NetDA4_3: DA4.3(A2) R30.2
NetDA5_1: DA5.1(A1) R23.2
NetDA5_3: DA5.3(A2) R31.2
NetDA6_1: DA6.1(A1) R24.2
NetDA6_3: DA6.3(A2) R32.2
NetDA13_1: DA13.1(A) R47.2
NetDA13_4: DA13.4(Drain2) DA13.6(Drain1) VD26.A X33.1 XP9.2
NetDA13_5: DA13.5(Source1.2) X33.2 XP10.1
NetDA14_1: DA14.1(A) R49.2
NetDA14_4: DA14.4(Drain2) DA14.6(Drain1) VD27.A X32.1 XP7.2
NetDA14_5: DA14.5(Source1.2) X32.2 XP8.1
NetDA15_1: DA15.1(A) R46.2
NetDA15_4: DA15.4(Drain2) DA15.6(Drain1) VD28.A X31.1 XP5.2
NetDA15_5: DA15.5(Source1.2) X31.2 XP6.1
NetDA16_1: DA16.1(A) R48.2
NetDA16_4: DA16.4(Drain2) DA16.6(Drain1) VD29.A X30.1 XP3.2
NetDA16_5: DA16.5(Source1.2) X30.2 XP4.1
NetDA18_10: DA18.10(EN2) R64.1
NetDA18_11: DA18.11(IND) DA19.6(Dout)
NetDA18_12: DA18.12(OUTC) DA19.5(Din)
NetDA18_13: DA18.13(OUTB) DA19.1(nCS)
NetDA18_14: DA18.14(OUTA) DA19.7(CLK)
NetDA19_2: DA19.2(CH0) R65.1 R66*.2
NetDD1_70: DD1.70(PA11) R10.1
NetDD1_71: DD1.71(PA12) R8.1
NetDD3_12: DD3.12(CANL) R33.1 R35.1
NetDD3_13: DD3.13(CANH) R34.1 XP2.1
NetDD4_9: DD4.9(B) R69.2 R72.2 X45.3
NetDD4_11: DD4.11(A) R69.1 R71.2 X45.4
NetDD4_12: DD4.12(ISORO) DD4.15(ISORI)
NetDD5_4: DD5.4(nRE) R77.2
NetDD5_9: DD5.9(B) R70.2 R74.2 X45.5
NetDD5_11: DD5.11(A) R70.1 R73.2 X45.6
NetDD5_12: DD5.12(ISORO) DD5.15(ISORI)
NetR5_1: R5.1 VD1.2(K)
NetR7_1: R7.1 VD3.K
NetR8_2: R8.2 X5.3(D+)
NetR10_2: R10.2 X5.2(D-)
NetR11_2: R11.2 VD5.K
NetR12_2: R12.2 VD6.K
NetR13_2: R13.2 VD7.K
NetR14_1: R14.1 VD8.2(K)
NetR15_1: R15.1 VD9.2(K)
NetR16_2: R16.2 XP1.1
NetR17_2: R17.2 VD10.1(A)
NetR18_2: R18.2 VD11.1(A)
NetR19_2: R19.2 VD12.1(A)
NetR20_2: R20.2 VD13.1(A)
NetR25_2: R25.2 VD14.1(A)
NetR26_2: R26.2 VD15.1(A)
NetR27_2: R27.2 VD16.1(A)
NetR28_2: R28.2 VD17.1(A)
NetR33_2: R33.2 XP2.2
NetR36_1: R36.1 VD18.2(K)
NetR45_1: R45.1 VD20.2(K)
NetR71_1: R71.1 VD30.2(K)
NetR72_1: R72.1 VD31.2(K)
NetR73_1: R73.1 VD32.2(K)
NetR74_1: R74.1 VD33.2(K)
NetTP11_1: TP11.1 X5.1(VBus)
NetX10_3: X10.3 X10.4 X10.7 X11.3 X11.4 X11.7

Not connected (* = marked no-connect by the designer): DA1 9(Common)* 11(Vout(GND))*; DA19 3(CH1); DD1 7(PC13)* 15(PC0)* 16(PC1)* 17(PC2_C)* 18(PC3_C)* 20(VREF+)* 22(PA0-WKUP)* 23(PA1)* 24(PA2)* 25(PA3)* 28(PA4)* 37(PE7)* 53(PB14)* 54(PB15)* 55(PD8)* 56(PD9)* 57(PD10)* 58(PD11)* 59(PD12)* 60(PD13)* 61(PD14)* 62(PD15)* 66(PC9)* 67(PA8)* 69(PA10)* 77(PA15)* 81(PD0)* 95(PB8)* 96(PB9)*; DD2 10(ISODE)*; DD4 13(ISODE); DD5 13(ISODE); R6 1; R9 1; TP2 1; VD2 K; VD3 A; VD4 K; VD19 A; X3 15* 16* 21* 22*; X4 6*; X10 2

## Notes on the sheet
- SWD
- (near X34) DigIN1
- (near X35) DigIN2
- (near R65) R65, R67 должны иметь значение не менее 10 Ом
- (near X42) ADC
- (near X36) DigIN3
- (near X37) DigIN4
- USB
- (near X38) DigIN5
- (near X39) DigIN6
- (near X40) DigIN7
- (near X41) DigIN8
- DigOUT1
- Элементы со знаком * по умолчанию не устанавливаются
- SSI
- DigOUT2
- DigOUT3
- RS485
- (near X33) DigOUT4
- PWR + CAN
- 1
- Зам.
- АДН200.010-18
- Контроллер
  универсальный
- Labels drawn without touching a wire or pin: CANFD_H
- Перв.примен.
- Справ.№
- Подп. и дата
- Инв.№ дубл.
- Взам.инв.№
- Подп.и дата
- Разраб.
- Изм.
- Лист
- № докум.
- Подп.
- Дата
- Лит.
- Масштаб
- Масса
- Т.контр.
- Пров.
- СХЕМА   ЭЛЕКТРИЧЕСКАЯ
- ПРИНЦИПИАЛЬНАЯ
- Листов
- Инв.№ подл.
- Утв.
- Н.контр.
- Нач.сект.
- Формат  A1

## Library data of the parts
C1-C11 C13 C21 C22 C33 C34 = 0805C-10UF-16V-X5R-TDK: CAPACITOR 0805 CERAMIC; Manufacturer Part Number: C2012X5R1C106M; Manufacturer: TDK Corporation; REEL: C63; Supplier 1: Digi-Key; Supplier Part Number 1: 445-4115-2-ND
C12 C17 = PANACAP-47UF-6V3-FK: GENERIC CAPACITOR POLARISED; Supplier 1: Digi-Key; Supplier Part Number 1: PCE4374TR-ND
C14-C16 = PANACAP-10UF-50V-FK: GENERIC CAPACITOR POLARISED; Supplier 1: Digi-Key; Supplier Part Number 1: PCE3807TR-ND
C18 = PANACAP-10UF-16V-FK: GENERIC CAPACITOR POLARISED; Supplier 1: Digi-Key; Supplier Part Number 1: PCE3782TR-ND
C19 C20 C35 C40-C43 C45-C48 = 0805C-100nF-25V-X7R-MUR: CAPACITOR 0805 CERAMIC; Supplier 1: Digi-Key; Supplier Part Number 1: 490-1673-1-ND
C36 C37 = 0805C-22UF-X7R-35V: Cap 0805 ceramic; Supplier 1: Digi-Key; Supplier Part Number 1: 399-3880-6-ND
DA1 = TEL 5-2410: Dual pin, Isolated; ComponentLink1Description: Datasheet; ComponentLink1URL: http://www.farnell.com/datasheets/2096722.pdf?_ga=2.247709198.827911468.1521701334-211038959.1501835619; Supplier 1: Mouser; Supplier 2: Farnell; Supplier 3: Newark; Supplier 4: RSComponents; Supplier Part Number 1: 495-TEL-5-2410; Supplier Part Number 2: 1196493; Supplier Part Number 3: 51R4805; Supplier Part Number 4: 466-7095
DA2 = TSR 1-2433: non isolated DC/DC Step-Down Converter; ComponentLink1Description: Datasheet; ComponentLink1URL: http://www.farnell.com/datasheets/2360311.pdf?_ga=2.185424160.827911468.1521701334-211038959.1501835619
DA3-DA6 = ILD207T: Optocoupler, Phototransistor Output, Dual Channel; ComponentLink1Description: Datasheet; ComponentLink1URL: https://www.vishay.com/docs/83647/ild205t.pdf; Supplier 1: RSComponents; Supplier 2: Arrow; Supplier 3: Farnell; Supplier 4: Newark; Supplier 5: Digi-Key; Supplier 6: Arrow; Supplier Part Number 1: 710-4884P; Supplier Part Number 2: ILD207T**MULT1; Supplier Part Number 3: 1469603; Supplier Part Number 4: 67T1290; Supplier Part Number 5: 751-1310-6-ND; Supplier Part Number 6: ILD207T
DA13-DA16 = PVG612SPbF: Microelectronic Power IC / HEXFET® Power MOSFET Photovoltaic Relay / Single-Pole, Normally-Open, 0-60V, 1.0A AC / 2.0A DC; Supplier 1: RSComponents; Supplier 2: Digi-Key; Supplier 3: Farnell; Supplier Part Number 1: 7840331; Supplier Part Number 2: PVG612SPBF-ND; Supplier Part Number 3: 1704181; ComponentLink1Description: Datasheet; ComponentLink1URL: http://www.farnell.com/datasheets/2144238.pdf?_ga=2.186057961.178473304.1520853739-1946584221.1511161143
DA19 = MCP3202: 12 BIT A/D CONVERTOR; Supplier 1: Digi-Key; Supplier 2: Mouser; Supplier 3: Arrow; ComponentLink1Description: Datasheet; ComponentLink1URL: http://www.microchip.com/mymicrochip/filehandler.aspx?ddocname=en011281; Supplier Part Number 1: MCP3202-CI/SN-ND; Supplier Part Number 2: 579-MCP3202-CI/SN; Supplier Part Number 3: MCP3202-CI/SN
DD1 = STM32H743VI6: ARM-based 32-bit Microcontroller; ComponentLink1Description: Datasheet; ComponentLink1URL: http://www.st.com/content/ccc/resource/technical/document/datasheet/group3/23/be/db/eb/29/39/4b/eb/DM00387108/files/DM00387108.pdf/jcr:content/translations/en.DM00387108.pdf; ComponentLink2Description: Reference manual; ComponentLink2URL: http://www.st.com/resource/en/reference_manual/dm00314099.pdf; Supplier 1: Newark; Supplier 2: Digi-Key; Supplier 3: Mouser; Supplier 4: Farnell; Supplier Part Number 1: 47AC1654; Supplier Part Number 2: 497-17720-ND; Supplier Part Number 3: 511-STM32H743VIT6; Supplier Part Number 4: 2820776
DD2 = iso1176: rs485 isolated; ComponentLink1Description: Datasheet; ComponentLink1URL: http://www.ti.com/lit/ds/symlink/iso1176.pdf; Supplier 1: Mouser; Supplier 2: Newark; Supplier 3: Mouser; Supplier 4: Digi-Key; Supplier 5: Mouser; Supplier 6: Newark; Supplier 7: RSComponents; Supplier 8: Farnell; Supplier Part Number 1: 595-ISO1176DWR; Supplier Part Number 2: 33AC5093; Supplier Part Number 3: 595-ISO1176TDW; Supplier Part Number 4: 296-23604-5-ND; Supplier Part Number 5: 595-ISO1176DW; Supplier Part Number 6: 13N4111; Supplier Part Number 7: 709-3015; Supplier Part Number 8: 1755037
DD3 = TJA1052i(iso): CAN transceiver that provides a galvanically isolated / interface between a Controller Area Network (CAN) protocol controller and the physical / two-wire CAN bus.; Supplier 1: Arrow; Supplier 2: Newark; Supplier 3: Digi-Key; Supplier 4: Arrow; Supplier 5: Arrow; Supplier 6: Newark; Supplier 7: Farnell; Supplier Part Number 1: TJA1052IT/5Y**MULT1; Supplier Part Number 2: 61X9998; Supplier Part Number 3: TJA1052IT/5Y-ND; Supplier Part Number 4: TJA1052IT/2Y; Supplier Part Number 5: TJA1052IT/1Y; Supplier Part Number 6: 70W0765; Supplier Part Number 7: 2400552; ComponentLink1Description: Datasheet; ComponentLink1URL: http://www.farnell.com/datasheets/2045698.pdf?_ga=2.184117990.1363533209.1521435310-1946584221.1511161143
DD4 DD5 = IL3685: RS485 isolated interface
L1 = INDUCTOR
L2 = 4U7-VLS3012-TDK: TDK-VLS3012-4u7; Manufacturer: TDK Corporation; Manufacturer Part Number: VLS3012T-4R7M1R0; Reel: L3; Supplier 1: Digi-Key; Supplier Part Number 1: 445-3686-6-ND
R1-R4 R54 R75 R76 = 0805R-10K: RESISTOR 0805 1/4 WATT THIN FILM; Reel: *
R5 R17-R20 R25-R28 = 0805R-33: RESISTOR 0805 1/4 WATT THIN FILM; Reel: *
R6 R11-R13 R16 R33 R46-R49 R69 R70 = 0805R-120: RESISTOR 0805 1/4 WATT THIN FILM; Reel: *
R7 = 0805R-330: RESISTOR 0805 1/4 WATT THIN FILM; Reel: *
R8 R10 = 0805R-22: RESISTOR 0805 1/4 WATT THIN FILM; Reel: *
R9 = 0805R-1K2: RESISTOR 0805 1/4 WATT THIN FILM; Reel: *
R14 R15 R36 R45 R71-R74 = 0805R-1R: RESISTOR 0805 1/3 WATT; REEL: R84; Supplier 1: Digi-Key; Supplier Part Number 1: 541-1.0TADKR-ND
R21-R24 R29-R32 R37-R44 R56* R57* R58* R59* R60* R61* R62* R63* R64 R65 R66* R77 = 0805R-1K: RESISTOR 0805 1/4 WATT THIN FILM; Reel: *
R34 R35 = 0805R-27: RESISTOR 0805 1/4 WATT THIN FILM; Reel: *
SW1 = SW-DIP12-SMD: 6 POLE DIP SWITCH SMD
SW2 = SW-PB-BLUE: SW-D6-R / SW-DS-S / SW-14X14 / SW-7X7
TP1-TP13 = TESTPOINT: TESTPOINT SCOPE GRABBER; Manufacturer Part Number: 5010; Manufacturer: Keystone Electronics; Reel: TH; Supplier 1: Digi-Key; Supplier Part Number 1: 5010K-ND
VD1 VD10-VD17 = SMBJ24CA-TR: TVS diode, bidirectional.; Supplier 1: Digi-Key; Supplier 2: Farnell; Supplier 3: Newark; Supplier Part Number 1: 497-3141-6-ND; Supplier Part Number 2: 9886206; Supplier Part Number 3: 34X2830; ComponentLink1Description: Datasheet; ComponentLink1URL: http://www.farnell.com/datasheets/1761316.pdf?_ga=2.22957819.178473304.1520853739-1946584221.1511161143
VD2-VD7 = TOPLED-GREEN
VD19 = MBRS140: DIODE; Supplier 1: Digi-Key; Supplier Part Number 1: MBRS140FSTR-ND
VD25-VD29 = NRVBS3100T3G: Выпрямитель Шоттки, AEC-Q101, 100 В, 3 А, Одиночный, SMC, 2 вывод(-ов), 900 мВ; ComponentLink1Description: shop_farnell; ComponentLink1URL: http://ru.farnell.com/on-semiconductor/nrvbs3100t3g/schottky-rect-3a-100v-smc/dp/2533243RL; ComponentLink2Description: Datasheet; ComponentLink2URL: http://www.farnell.com/datasheets/2353895.pdf?_ga=2.95207582.342609463.1527139818-1946584221.1511161143; Supplier 1: Newark; Supplier 2: Farnell; Supplier 3: Digi-Key; Supplier 4: Mouser; Supplier 5: Mouser; Supplier 6: Digi-Key; Supplier Part Number 1: 76T6664; Supplier Part Number 2: 2533243; Supplier Part Number 3: NRVBS3100T3GOSCT-ND; Supplier Part Number 4: 863-NRVBS3100T3G; Supplier Part Number 5: 863-SURS8220T3G; Supplier Part Number 6: SURS8220T3GOSDKR-ND
X3 = MPSC-01-24-01-7.70-01-L-V: 5.00 mm PowerStrip™/30 A Signal/Power; Supplier 1: Digi-Key; Supplier Part Number 1: MPSC-01-24-01-7.70-01-L-V-ND
X4 = HEADER-1X6: Supplier 1: Digi-Key; Supplier Part Number 1: S1011E-36-ND
X5 = USB-B: USB B DEVICE CONNECTOR; Text Field1: Assmann; Text Field2: AU-Y1007; Text Field3: Digi-Key; Text Field4: AE1085-ND; Text Field5: Thru-Hole; Text Field6: 1.168; NI?: *; O?: *; Section:: *
X6 = HEADER-1X5: REEL: TH; Supplier 1: Digi-Key; Supplier Part Number 1: S1011E-36-ND
X10 X11 X45 = HEADER-1X8: Supplier 1: Digi-Key; Supplier Part Number 1: S1011E-36-ND
X30-X33 X42 = HEADER-1X4: Supplier 1: Digi-Key; Supplier Part Number 1: S1011E-36-ND
X34-X41 = HEADER-1X3: Supplier 1: Digi-Key; Supplier Part Number 1: S1011E-36-ND
XP1-XP10 = (no symbol name): REEL: TH; Supplier 1: Digi-Key; Supplier Part Number 1: S1011E-36-ND
ZQ1 ZQ2 = 16MC-HC49US: 16MHZ CRSYTAL HC49US; Supplier 1: Mouser; Supplier Part Number 1: 815-ABLS-16.0M-T
VD8 VD9 VD18 VD20 VD30-VD33 = SMBJ5.0CA: Supplier 1: Digi-Key; Supplier 2: Farnell; Supplier 3: Arrow; Supplier 4: Mouser; Supplier 5: Allied Electronics; Supplier 6: Farnell; Supplier Part Number 1: 497-3145-6-ND; Supplier Part Number 2: 2252494; Supplier Part Number 3: SMBJ5.0CA-TR; Supplier Part Number 4: 511-SMBJ5.0CA; Supplier Part Number 5: 70014030; Supplier Part Number 6: 2419289; ComponentLink1Description: Datasheet; ComponentLink1URL: http://www.farnell.com/datasheets/1761316.pdf?_ga=2.252860928.827911468.1521701334-211038959.1501835619